# Altium schematic sheet 04-POWERV2.4.SchDoc
size A4
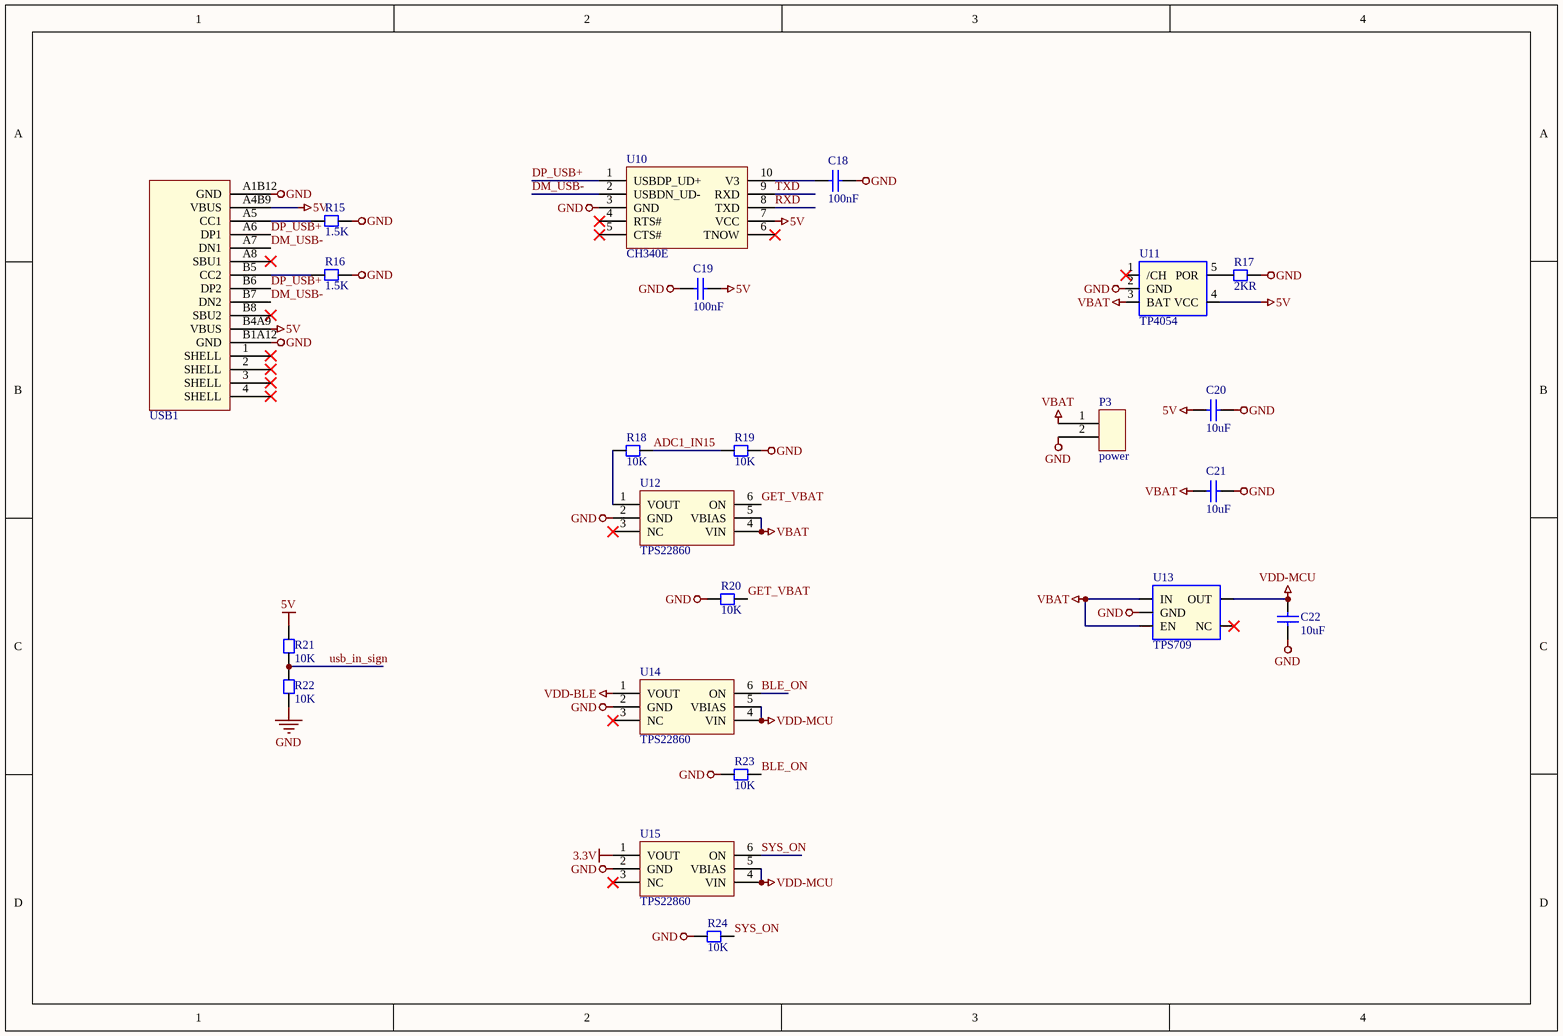
[diagram p0: 04-POWERV2.4.SchDoc]

## Parts
C18  100nF  [CC1005-0402]
C19  100nF  [CC1005-0402]
C20  10uF  [CC1005-0402]
C21  10uF  [CC1005-0402]
C22  10uF  [CC1005-0402]
P3  power  [POWER-3.7V]
R15  1.5K  [CR1005-0402]
R16  1.5K  [CR1005-0402]
R17  2KR  [CR1005-0402]
R18  10K  [CR1005-0402]
R19  10K  [CR1005-0402]
R20  10K  [CR1005-0402]
R21  10K  [CR1005-0402]
R22  10K  [CR1005-0402]
R23  10K  [CR1005-0402]
R24  10K  [CR1005-0402]
U10  CH340E  [MSOP-10]
U11  TP4054  [SOT23-5]
U12  TPS22860  [SOT23-6]
U13  TPS709  [SOT23-5]
U14  TPS22860  [SOT23-6]
U15  TPS22860  [SOT23-6]
USB1  Tpye-c 16P  [TYPE-C 16P]  (value not drawn)

## Nets
3.3V: U15.1(VOUT)
5V: C19.2 C20.2 R21.1 U10.7(VCC) U11.4(VCC) USB1.A4B9(VBUS) USB1.B4A9(VBUS)
GND: C18.2 C19.1 C20.1 C21.1 C22.2 P3.2 R15.1 R16.1 R17.1 R19.2 R20.1 R22.2 R23.1 R24.1 U10.3(GND) U11.2(GND) U12.2(GND) U13.2(GND) U14.2(GND) U15.2(GND) USB1.A1B12(GND) USB1.B1A12(GND)
VBAT: C21.2 P3.1 U11.3(BAT) U12.4(VIN) U12.5(VBIAS) U13.1(IN) U13.3(EN)
VDD-BLE: U14.1(VOUT)
VDD-MCU: C22.1 U13.5(OUT) U14.4(VIN) U14.5(VBIAS) U15.4(VIN) U15.5(VBIAS)
ADC1_IN15: R18.1 R19.1
BLE_ON: R23.2 U14.6(ON)
DM_USB-: U10.2(USBDN_UD-) USB1.A7(DN1) USB1.B7(DN2)
DP_USB+: U10.1(USBDP_UD+) USB1.A6(DP1) USB1.B6(DP2)
GET_VBAT: R20.2 U12.6(ON)
RXD: U10.8(TXD)
SYS_ON: R24.2 U15.6(ON)
TXD: U10.9(RXD)
usb_in_sign: R21.2 R22.1
NetC18_1: C18.1 U10.10(V3)
NetR15_2: R15.2 USB1.A5(CC1)
NetR16_2: R16.2 USB1.B5(CC2)
NetR17_2: R17.2 U11.5(POR)
NetR18_2: R18.2 U12.1(VOUT)

Not connected (* = marked no-connect by the designer): U10 4(RTS#)* 5(CTS#)* 6(TNOW)*; U11 1(/CH)*; U12 3(NC)*; U13 4(NC)*; U14 3(NC)*; U15 3(NC)*; USB1 1(SHELL)* 2(SHELL)* 3(SHELL)* 4(SHELL)* A8(SBU1)* B8(SBU2)*

## Library data of the parts
C18-C22 = Chip capacitor: 贴片电容
R15-R24 = Chip resistor: 贴片电阻
U10 = CH340E: usd转串口芯片 MSOP10封装
U11 = TP4054: 迷你充电IC SOT-23-5
U12 U14 U15 = TPS22860: 超低泄漏电流负载开关  超低泄漏电流负载开关 它可支持最大 200mA 的持续电 / 流。 此开关可由一个打开/关闭输入 (ON) 控制
U13 = TPS709: 3.3V降压IC SOT23-5封装 最大输出150ma电流
USB1 = Tpye-c 16P: 16P 封装的TYPE -c接口 4固定插脚 双向